# Altium schematic sheet p1_PCB_capteurs.SchDoc
size A3; SheetNumber: 1; SheetTotal: 1
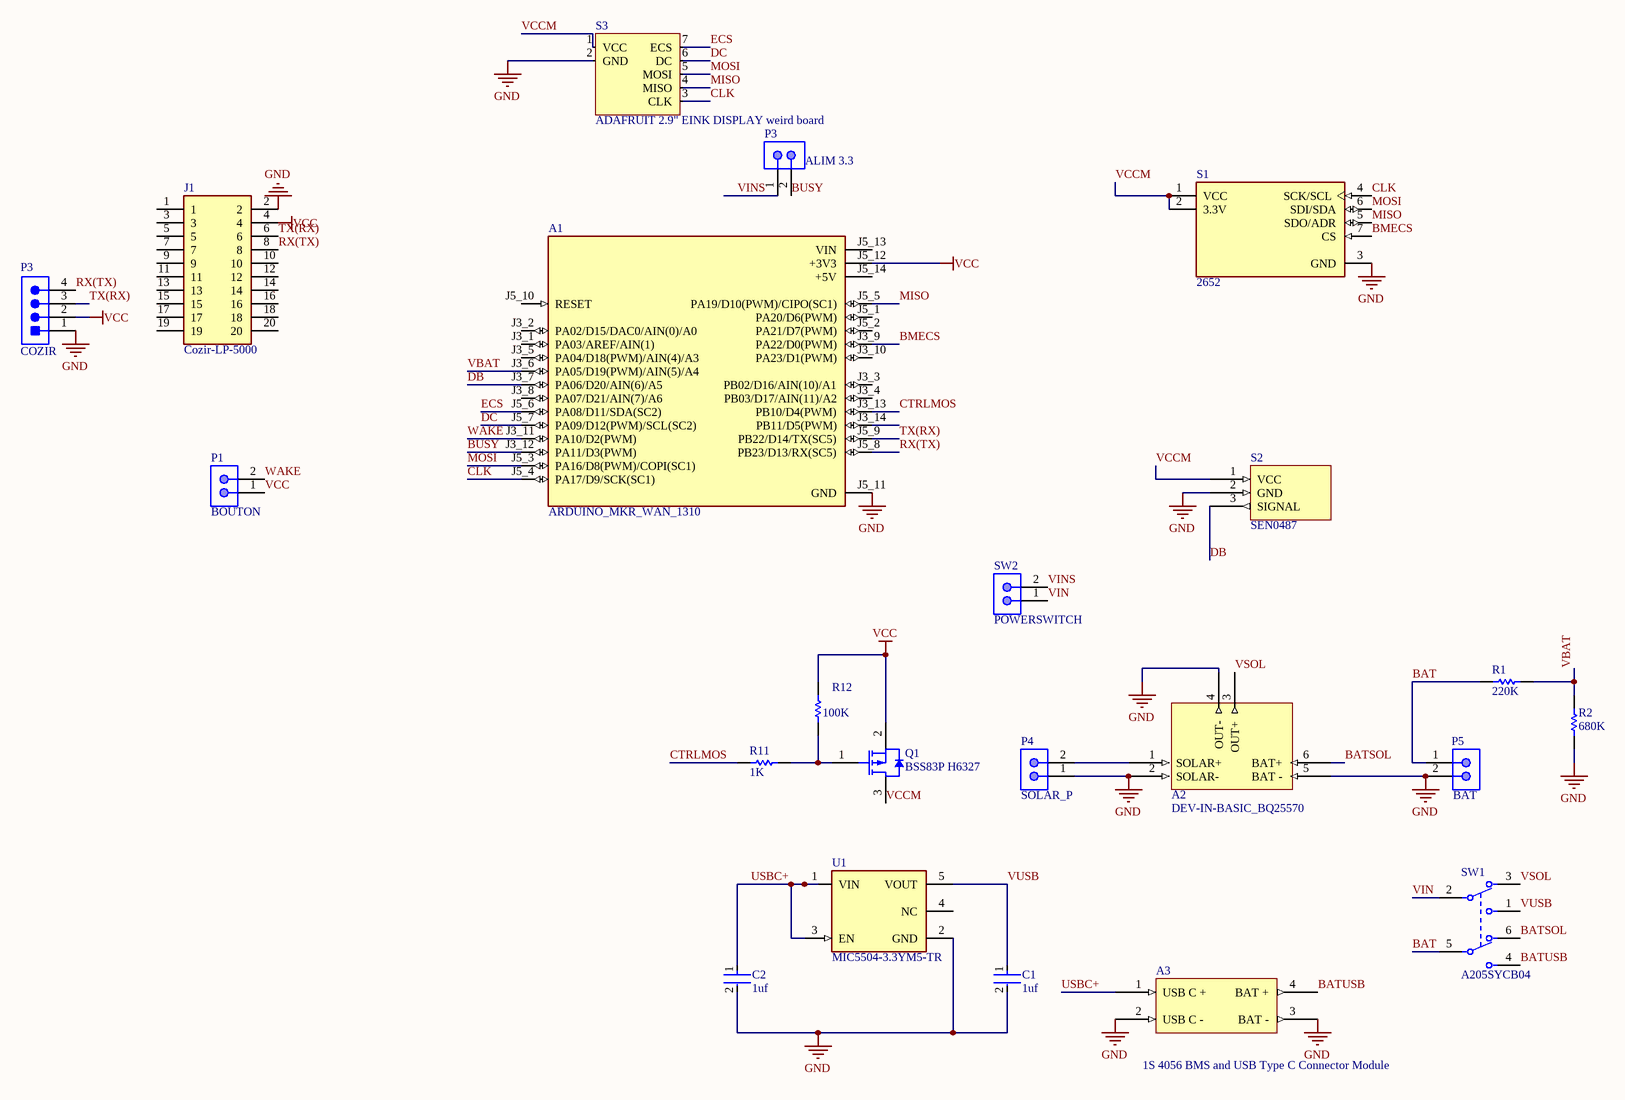
[diagram p0: p1_PCB_capteurs.SchDoc]

## Parts
(Parts that share a designator on the sheet are numbered #1, #2 ... from top to bottom, then left to right.)
A1  ARDUINO_MKR_WAN_1310  [BOARD_ARDUINO_MKR_WAN_1310]
A2  DEV-IN-BASIC_BQ25570  [DEV-IN-BASIC_BQ25570-Footprint-1]
A3  1S 4056 BMS and USB Type C Connector Module  [1S 4056 BMS and USB Type C Connector Module-Footprint-1]
C1  1uf  [FP-CC0805-0_85-MFG]
C2  1uf  [FP-CC0805-0_85-MFG]
J1  Cozir-LP-5000  [M503201045]
P1  BOUTON  [MOLX-22-23-2021_V]
P3#1  ALIM 3.3  [MOLX-22-23-2021_V]
P3#2  COZIR  [MOLX-22-27-2041_V]  (graphical)
P4  SOLAR_P  [MOLX-22-23-2021_V]
P5  BAT  [MOLX-22-23-2021_V]
Q1  BSS83P H6327  [INF-SOT23_L]
R1  220K  [RESC2013X60X35ML10T20]
R2  680K  [RESC2013X60X35ML10T20]
R11  1K  [RESC2013X60X35ML10T20]
R12  100K  [RESC2013X60X35ML10T20]
S1  2652  [FP-2652-MFG]
S2  SEN0487  [SEN0487-Footprint-1]
S3  ADAFRUIT 2.9" EINK DISPLAY weird board  [MODULE_FEATHER_M0_BASIC_PROTO]
SW1  A205SYCB04  [FP-A205SYCB04-MFG]
SW2  POWERSWITCH  [MOLX-22-23-2021_V]
U1  MIC5504-3.3YM5-TR  [FP-SOT23-5LD-PL-1-MFG]

## Nets
GND: A1.J5_11(GND) A2.2(SOLAR-) A2.4(OUT-) A2.5(BAT_-) A3.2(USB_C_-) A3.3(BAT_-) C1.2 C2.2 J1.2 P3#2.1 P4.1 P5.2 R2.1 S1.3(GND) S2.2(GND) S3.2(GND) U1.2(GND)
VCC: A1.J5_12(+3V3) J1.4 P1.1 P3#2.2 Q1.2(SOURCE) R12.2
BAT: P5.1 R1.1 SW1.5
BATSOL: A2.6(BAT+) SW1.6
BATUSB: A3.4(BAT_+) SW1.4
BMECS: A1.J3_9(PA22/D0(PWM)) S1.7(CS)
BUSY: A1.J3_12(PA11/D3(PWM)) P3#1.2
CLK: A1.J5_4(PA17/D9/SCK(SC1)) S1.4(SCK/SCL) S3.3(CLK)
CTRLMOS: A1.J3_13(PB10/D4(PWM)) R11.1
DB: A1.J3_7(PA06/D20/AIN(6)/A5) S2.3(SIGNAL)
DC: A1.J5_7(PA09/D12(PWM)/SCL(SC2)) S3.6(DC)
ECS: A1.J5_6(PA08/D11/SDA(SC2)) S3.7(ECS)
MISO: A1.J5_5(PA19/D10(PWM)/CIPO(SC1)) S1.5(SDO/ADR) S3.4(MISO)
MOSI: A1.J5_3(PA16/D8(PWM)/COPI(SC1)) S1.6(SDI/SDA) S3.5(MOSI)
RX(TX): A1.J5_8(PB23/D13/RX(SC5)) J1.8 P3#2.4
TX(RX): A1.J5_9(PB22/D14/TX(SC5)) J1.6 P3#2.3
USBC+: A3.1(USB_C_+) C2.1 U1.1(VIN) U1.3(EN)
VBAT: A1.J3_6(PA05/D19(PWM)/AIN(5)/A4) R1.2 R2.2
VCCM: Q1.3(DRAIN) S1.1(VCC) S1.2(3.3V) S2.1(VCC) S3.1(VCC)
VIN: SW1.2 SW2.1
VINS: P3#1.1 SW2.2
VSOL: A2.3(OUT+) SW1.3
VUSB: C1.1 SW1.1 U1.5(VOUT)
WAKE: A1.J3_11(PA10/D2(PWM)) P1.2
NetA2_1: A2.1(SOLAR+) P4.2
NetQ1_1: Q1.1(GATE) R11.2 R12.1

Not connected (* = marked no-connect by the designer): A1 J3_1(PA03/AREF/AIN(1)) J3_2(PA02/D15/DAC0/AIN(0)/A0) J3_3(PB02/D16/AIN(10)/A1) J3_4(PB03/D17/AIN(11)/A2) J3_5(PA04/D18(PWM)/AIN(4)/A3) J3_8(PA07/D21/AIN(7)/A6) J3_10(PA23/D1(PWM)) J3_14(PB11/D5(PWM)) J5_1(PA20/D6(PWM)) J5_2(PA21/D7(PWM)) J5_10(RESET) J5_13(VIN) J5_14(+5V); J1 1 3 5 7 9 10 11 12 13 14 15 16 17 18 19 20; U1 4(NC)

## Library data of the parts
A1 = ARDUINO_MKR_WAN_1310: Arduino Pro; LoRa; SAM D21; 5VDC; Flash: 256kB; SRAM: 32kB; MP: ARDUINO MKR WAN 1310; Availability: Not in stock; Check_prices: https://www.snapeda.com/parts/ARDUINO%20MKR%20WAN%201310/Arduino/view-part/?ref=eda; Package: None; MF: Arduino; Price: None; SnapEDA_Link: https://www.snapeda.com/parts/ARDUINO%20MKR%20WAN%201310/Arduino/view-part/?ref=snap; Value: *
A2 = CMP-019-00049-1: Surface mounted dev board for bq 25570.
A3 = CMP-019-00050-2: pin to pad: 1>in+ 2>in- 3>BAT- 4>BAT+
C1 C2 = CMP-2100-03606-3: CAP CER 0.1UF 50V X7R 0805; Manufacturer Part Number: CC0805KRX7R9BB104; Manufacturer: Yageo; Tolerance: 0.1; Capacitance: 100 nF; Value: 100 nF; Material: Ceramic; Device Class L1: Passive Components; ComponentLink2Description: Datasheet; Package: CC0805-0.85; Digikey Description: CAP CER 0.1UF 50V X7R 0805; Device Class L3: Ceramic Capacitors; Temperature: -30°C to +85°C; Temperature Characteristic: X7R; Voltage Rating: 50 V; Height: 0.95mm; RoHS: TRUE; Ipc Land Pattern Name: CAPC200125X85; Device Class L2: Capacitors; Category: Cap; Temperature Range Low: -30°C; Temperature Range High: +85°C; Mouser Description: Multilayer Ceramic Capacitors MLCC - SMD/SMT 100nF 50V X7R 10%; Footprint Url: http://www.yageo.com/exep/pages/download/literatures/UPY-C_GEN_24.pdf; Automotive: No; Octopart: https://octopart.com/cc0805krx7r9bb104-yageo-192993; Lead Free: Yes; ComponentLink2URL: http://www.yageo.com/documents/recent/UPY-GPHC_Y5V_6.3V-to-50V_8.pdf
J1 = CMP-002-00071-1: 1.27mm (0.05") Pitch DIL Horizontal Throughboard Socket Assembly, gold, 10+10 contacts; Manufacturer_Name: Harwin; Geometry.Height: 3.6mm; Datasheet Link: https://cdn.harwin.com/pdfs/M50-320.pdf; Mouser Part Number: 855-M50-3201045; Manufacturer_Part_Number: M50-3201045; Design Item ID: M50-3201045; Source: M50-3201045.SchLib; Arrow Price/Stock: *; Arrow Part Number: *; Mouser Price/Stock: https://www.mouser.co.uk/ProductDetail/Harwin/M50-3201045?qs=Jph8NoUxIfWWs7EGVkz7wA%3D%3D
P1 P3#1 P4 P5 SW2 = CMP-1704-00001-3: Male Header, Pitch 2.54 mm, 1 x 2 Position, Height 10.67 mm, Tail Length 3.56 mm, 0 to 75 degC, RoHS, Bulk; Package Quantity: 3000; Height: 10.67 mm; RoHSCompliant: True; ComponentLink2URL: https://datasheet.ciiva.com/19454/232266-19454304.pdf; PartNumber: 22-23-2021; Packaging: Bulk; ComponentLink2Description: Datasheet; Min Operating Temperature: 0 degC; ComponentLink1Description: Manufacturer URL; Length: 5.08 mm; Mounting Technology: Through Hole; Max Operating Temperature: 75 degC; REACH SVHC: Unknown; PackageDescription: Male Header, Pitch 2.54 mm, 1 x 2 Position, Height 10.67 mm, Tail Length 3.56 mm; ComponentLink1URL: http://www.molex.com/; Mount: Through Hole; Radiation Hardening: No; Width: 6.35 mm; Pins: 2
P3#2 = CMP-2000-05243-1: Male Header, Pitch 2.54 mm, 1 x 4 Position, Height 11.7 mm, Tail Length 3.56 mm, RoHS, Bulk; Manufacturer: Molex; Voltage rating: 250V; Current rating: 4A; Datasheet Version: Rev. F, 06/2009; Operating temperature: 0degCto+75degC; Contact material: Tinplatedbrass; Manufacturer URL: http://www.molex.com/; Housing material: Nylon(UL94V-0); Datasheet URL: http://www.molex.com/pdm_docs/sd/022272041_sd.pdf
Q1 = CMP-2000-05970-1: SIPMOS(R) Small-Signal-Transistor, -0.33 A, 2 Ohm, -60 V, 3-Pin SOT-23, RoHS, Tape and Reel; Manufacturer: Infineon; Package Version: 04/2016; Mounting Technology: SurfaceMount; Manufacturer URL: http://www.infineon.com/; RoHS: Details; Package Description: 3-Pin Small Outline Transistor Package, Body 2.9 x 1.3 mm, Pitch 0.95 mm; Product Category: MOSFET; Datasheet Version: Rev. 1.5, 03/2012; Package Reference: SOT23; Package URL: http://www.infineon.com/dgdl/Infineon-PG-SOT23-3-5_BSS83PH6327XTSA1-PD-v01_00-EN.pdf?fileId=5546d46254e133b40154f1b7e80354af; Packaging: Reel; Datasheet URL: http://media.digikey.com/pdf/Data%20Sheets/Infineon%20PDFs/BSS83P%20H6327.pdf
R1 R2 R11 R12 = CMP-2100-03671-1: Chip Resistor, 1 KOhm, +/- 1%, 125 mW, -55 to 155 degC, 0805 (2012 Metric), RoHS, Tape and Reel; Manufacturer: Yageo; Temperature Coefficient: 100ppm/degreesC; Voltage Rating (DC): 150V; Max Power Dissipation: 125mW; Resistance: 1KOhm; Number of Pins: 2; Number of Terminations: 2; Datasheet URL: http://www.yageo.com/NewPortal/yageodocoutput?fileName=/pdf/R-Chip/PYu-RC_Group_51_RoHS_L_5.pdf; Length: 0.079inch; Package Description: 2-Pin Surface Mounted Device, Body 2 x 1.25 mm; Depth: 1.25mm; Height: 0.024inch; Military Standard: Not; Case/Package: 0805; Package Reference: 0805; RoHSCompliant: true; Lead Free: LeadFree; Packaging: TapeandReel; Package Quantity: 1; Datasheet Version: Rev. 5, 10/2016; Tolerance: 1%; Min Operating Temperature: -55degC; Voltage Rating: 150V; Composition: ThickFilm; Case Code (Imperial): 0805; Power Rating: 125mW; Width: 0.049inch; Case Code (Metric): 2012; Manufacturer URL: http://www.yageo.com/; Max Operating Temperature: 155degC; REACH SVHC: Unknown; Termination: SMD/SMT
S1 = CMP-144240-000001-1: SENSOR HUM/PRESS I2C/SPI BME280; Sensor Type: Temperature; Interface: I2C; Evaluation Kit: Yes; Package Quantity: 1
S2 = CMP-00030-00001-3: Fermion: MEMS Microphone Module - S15OT421(Breakout)
S3 = CMP-00030-00002-11: ADAFRUIT 2.9" EINK DISPLAY weird board for feather board adapted
SW1 = CMP-011-00013-1: Toggle Switch; RoHS Compliant: Yes
U1 = CMP-2000-07604-2: IC REG LINEAR 3.3V 300MA SOT23-5; Quiescent Current: 38uA; Operating Supply Current: 42uA; Max Input Voltage: 5.5V; Min Input Voltage: 2.5V; Output Type: Fixed; Power Supply Rejection Ratio (PSRR): 60dB; Dropout Voltage: 380mV; Accuracy: 3%; Number of Outputs: 1; Nominal Output Voltage: 3.3V; Max Output Current: 300mA; Length: 2.9mm; Mount: Surface Mount; Width: 1.6mm; Packaging: Tape and Reel; Output Current: 300mA; Min Operating Temperature: -40°C; Max Operating Temperature: 125°C; Height: 1.1mm; Case/Package: SOT-23-5; REACH SVHC: No SVHC; Number of Pins: 5; Output Voltage: 3.3V